# Altium schematic sheet DRV8300_GATES.SchDoc
size B
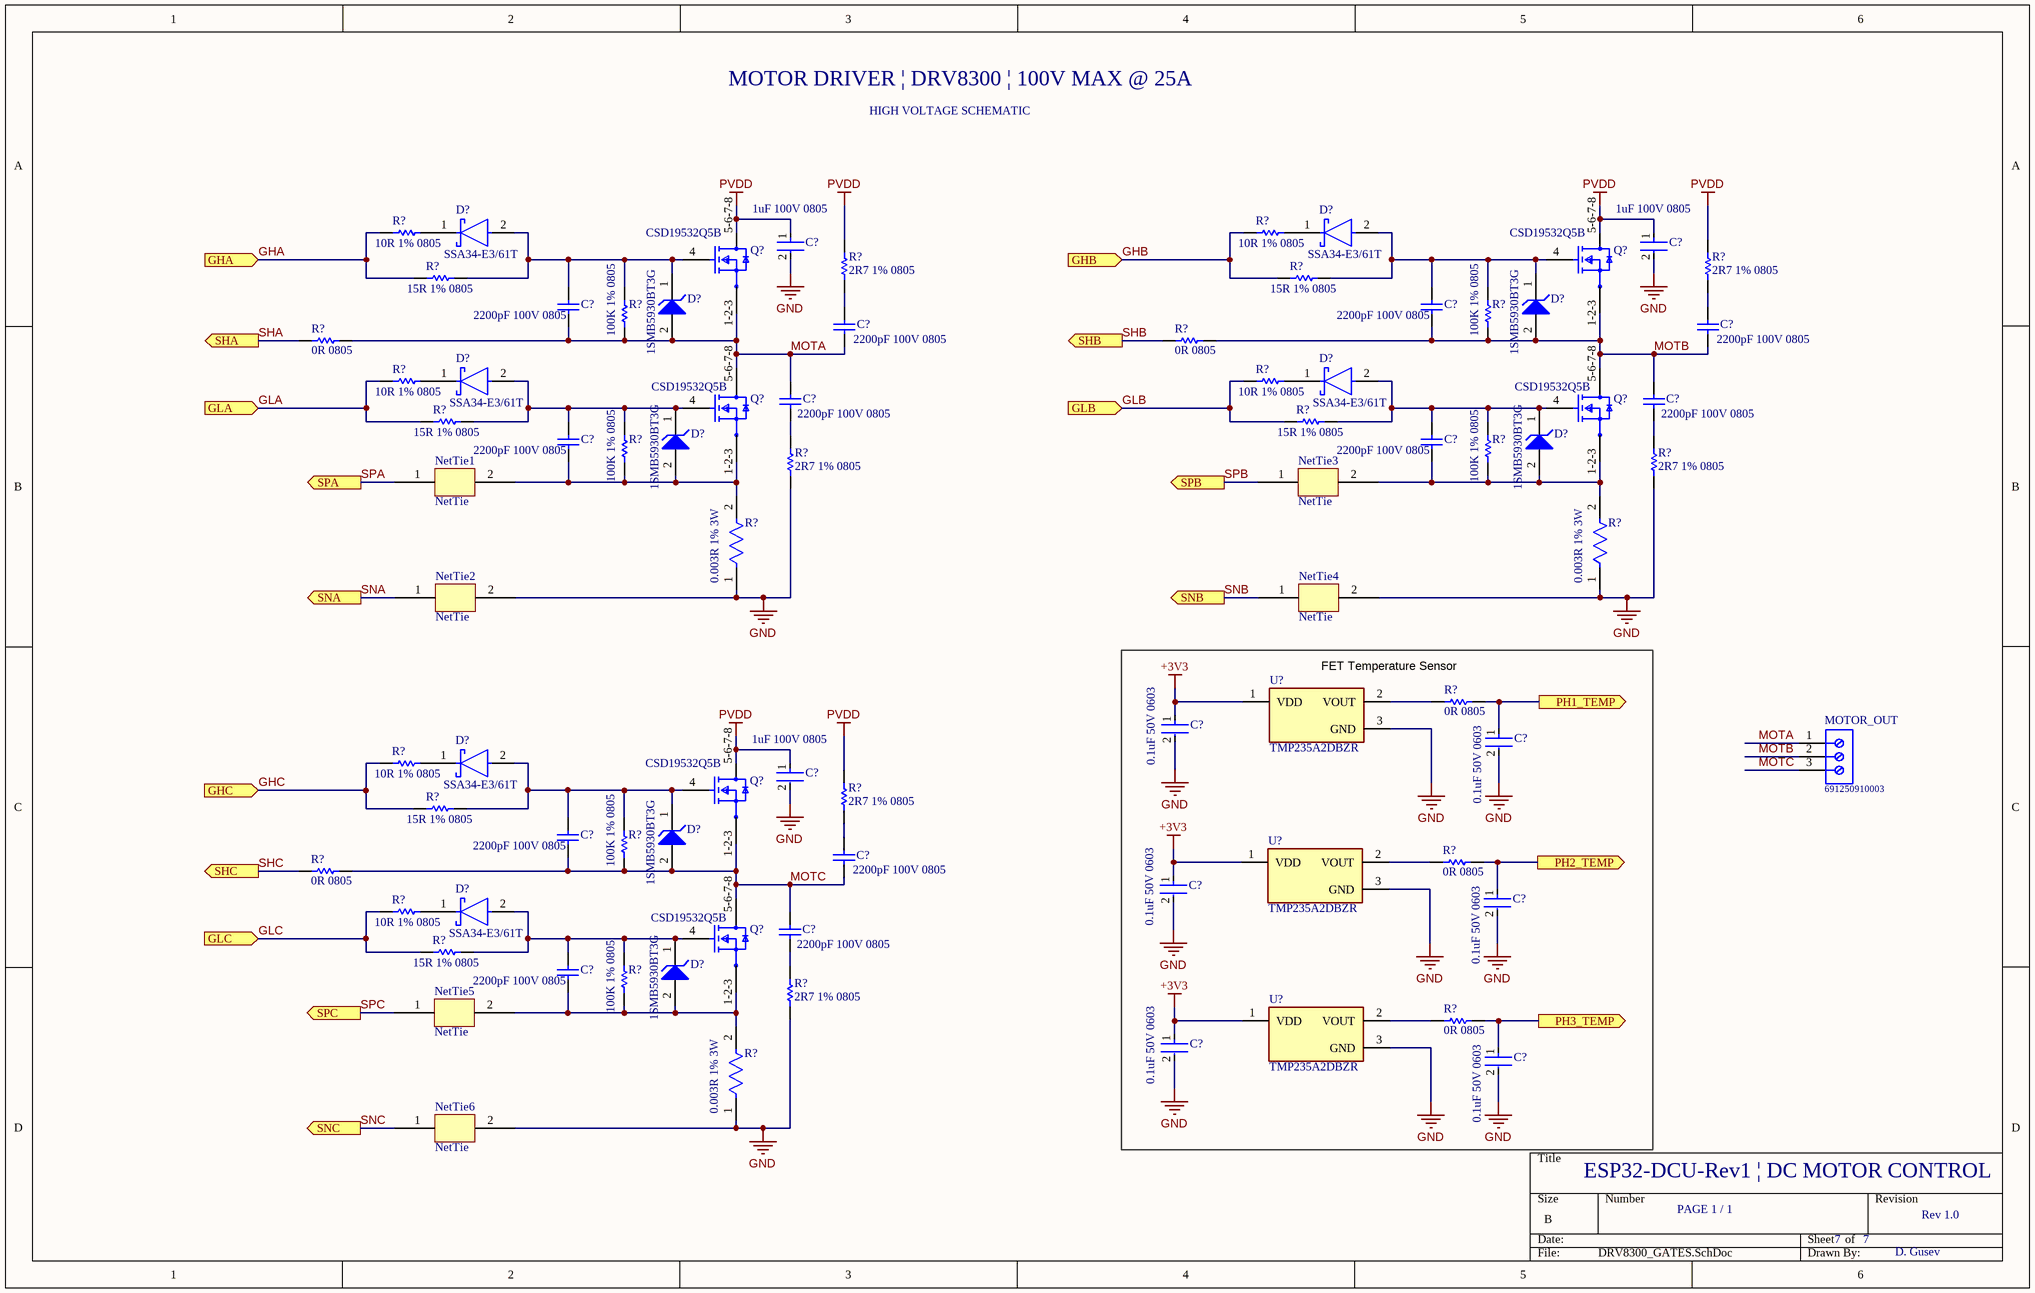
[diagram p0: DRV8300_GATES.SchDoc]

## Parts
(Parts that share a designator on the sheet are numbered #1, #2 ... from top to bottom, then left to right.)
C?#1  1uF 100V 0805  [FP-C2012-125-0_2-IPC_A]
C?#2  1uF 100V 0805  [FP-C2012-125-0_2-IPC_A]
C?#3  2200pF 100V 0805  [CAPC2013X94X50LL20T25]
C?#4  2200pF 100V 0805  [CAPC2013X94X50LL20T25]
C?#5  2200pF 100V 0805  [CAPC2013X94X50LL20T25]
C?#6  2200pF 100V 0805  [CAPC2013X94X50LL20T25]
C?#7  2200pF 100V 0805  [CAPC2013X94X50LL20T25]
C?#8  2200pF 100V 0805  [CAPC2013X94X50LL20T25]
C?#9  2200pF 100V 0805  [CAPC2013X94X50LL20T25]
C?#10  2200pF 100V 0805  [CAPC2013X94X50LL20T25]
C?#11  0.1uF 50V 0603  [FP-C0603C-CF-MFG]
C?#12  0.1uF 50V 0603  [FP-C0603C-CF-MFG]
C?#13  1uF 100V 0805  [FP-C2012-125-0_2-IPC_A]
C?#14  2200pF 100V 0805  [CAPC2013X94X50LL20T25]
C?#15  2200pF 100V 0805  [CAPC2013X94X50LL20T25]
C?#16  0.1uF 50V 0603  [FP-C0603C-CF-MFG]
C?#17  0.1uF 50V 0603  [FP-C0603C-CF-MFG]
C?#18  2200pF 100V 0805  [CAPC2013X94X50LL20T25]
C?#19  2200pF 100V 0805  [CAPC2013X94X50LL20T25]
C?#20  0.1uF 50V 0603  [FP-C0603C-CF-MFG]
C?#21  0.1uF 50V 0603  [FP-C0603C-CF-MFG]
D?#1  SSA34-E3/61T  [FP-95400-MFG]
D?#2  SSA34-E3/61T  [FP-95400-MFG]
D?#3  1SMB5930BT3G  [ONSC-SMB-2-403A-03_H_V]
D?#4  1SMB5930BT3G  [ONSC-SMB-2-403A-03_H_V]
D?#5  SSA34-E3/61T  [FP-95400-MFG]
D?#6  SSA34-E3/61T  [FP-95400-MFG]
D?#7  1SMB5930BT3G  [ONSC-SMB-2-403A-03_H_V]
D?#8  1SMB5930BT3G  [ONSC-SMB-2-403A-03_H_V]
D?#9  SSA34-E3/61T  [FP-95400-MFG]
D?#10  1SMB5930BT3G  [ONSC-SMB-2-403A-03_H_V]
D?#11  SSA34-E3/61T  [FP-95400-MFG]
D?#12  1SMB5930BT3G  [ONSC-SMB-2-403A-03_H_V]
MOTOR_OUT  691250910003  [691250910003]
NetTie1  NetTie  [NetTie]
NetTie2  NetTie  [NetTie]
NetTie3  NetTie  [NetTie]
NetTie4  NetTie  [NetTie]
NetTie5  NetTie  [NetTie]
NetTie6  NetTie  [NetTie]
Q?#1  CSD19532Q5B  [CSD19532Q5B]
Q?#2  CSD19532Q5B  [CSD19532Q5B]
Q?#3  CSD19532Q5B  [CSD19532Q5B]
Q?#4  CSD19532Q5B  [CSD19532Q5B]
Q?#5  CSD19532Q5B  [CSD19532Q5B]
Q?#6  CSD19532Q5B  [CSD19532Q5B]
R?#1  10R 1% 0805  [RESC2013X60X35ML10T20]
R?#2  10R 1% 0805  [RESC2013X60X35ML10T20]
R?#3  15R 1% 0805  [RESC2013X70X40NL20T20]
R?#4  15R 1% 0805  [RESC2013X70X40NL20T20]
R?#5  2R7 1% 0805  [RESC2013X70X40NL20T20]
R?#6  2R7 1% 0805  [RESC2013X70X40NL20T20]
R?#7  100K 1% 0805  [RESC2013X60X35ML10T20]
R?#8  100K 1% 0805  [RESC2013X60X35ML10T20]
R?#9  0R 0805  [RESC2013X60X35ML10T20]
R?#10  0R 0805  [RESC2013X60X35ML10T20]
R?#11  10R 1% 0805  [RESC2013X60X35ML10T20]
R?#12  10R 1% 0805  [RESC2013X60X35ML10T20]
R?#13  15R 1% 0805  [RESC2013X70X40NL20T20]
R?#14  15R 1% 0805  [RESC2013X70X40NL20T20]
R?#15  100K 1% 0805  [RESC2013X60X35ML10T20]
R?#16  100K 1% 0805  [RESC2013X60X35ML10T20]
R?#17  2R7 1% 0805  [RESC2013X70X40NL20T20]
R?#18  2R7 1% 0805  [RESC2013X70X40NL20T20]
R?#19  0.003R 1% 3W  [FP-CSR1225-IPC_C]
R?#20  0.003R 1% 3W  [FP-CSR1225-IPC_C]
R?#21  0R 0805  [RESC2013X60X35ML10T20]
R?#22  10R 1% 0805  [RESC2013X60X35ML10T20]
R?#23  15R 1% 0805  [RESC2013X70X40NL20T20]
R?#24  2R7 1% 0805  [RESC2013X70X40NL20T20]
R?#25  100K 1% 0805  [RESC2013X60X35ML10T20]
R?#26  0R 0805  [RESC2013X60X35ML10T20]
R?#27  0R 0805  [RESC2013X60X35ML10T20]
R?#28  10R 1% 0805  [RESC2013X60X35ML10T20]
R?#29  15R 1% 0805  [RESC2013X70X40NL20T20]
R?#30  100K 1% 0805  [RESC2013X60X35ML10T20]
R?#31  2R7 1% 0805  [RESC2013X70X40NL20T20]
R?#32  0R 0805  [RESC2013X60X35ML10T20]
R?#33  0.003R 1% 3W  [FP-CSR1225-IPC_C]
U?#1  TMP235A2DBZR  [FP-DBZ0003A-MFG]
U?#2  TMP235A2DBZR  [FP-DBZ0003A-MFG]
U?#3  TMP235A2DBZR  [FP-DBZ0003A-MFG]

## Blocks framed on the sheet
FET Temperature Sensor: C?#11 C?#12 C?#16 C?#17 C?#20 C?#21 R?#21 R?#26 R?#32 U?#1-U?#3

## Ports
GHA (in), GHB (in), GHC (in), GLA (in), GLB (in), GLC (in), PH1_TEMP (out), PH2_TEMP (out), PH3_TEMP (out), SHA (out), SHB (out), SHC (out), SNA (out), SNB (out), SNC (out), SPA (out), SPB (out), SPC (out)

## Nets
+3V3: C?#11.1 C?#16.1 C?#20.1 U?#1.1(VDD) U?#2.1(VDD) U?#3.1(VDD)
GND: C?#1.2 C?#2.2 C?#11.2 C?#12.2 C?#13.2 C?#16.2 C?#17.2 C?#20.2 C?#21.2 NetTie2.2 NetTie4.2 NetTie6.2 R?#17.1 R?#18.1 R?#19.1 R?#20.1 R?#31.1 R?#33.1 U?#1.3(GND) U?#2.3(GND) U?#3.3(GND)
PVDD: C?#1.1 C?#2.1 C?#13.1 Q?#1.5-6-7-8(D) Q?#2.5-6-7-8(D) Q?#5.5-6-7-8(D) R?#5.2 R?#6.2 R?#24.2
GHA: R?#1.1 R?#3.1 ; port GHA
GHB: R?#2.1 R?#4.1 ; port GHB
GHC: R?#22.1 R?#23.1 ; port GHC
GLA: R?#11.1 R?#13.1 ; port GLA
GLB: R?#12.1 R?#14.1 ; port GLB
GLC: R?#28.1 R?#29.1 ; port GLC
MOTA: C?#3.1 C?#5.1 C?#7.2 D?#3.2(A) MOTOR_OUT.1 Q?#1.1-2-3(S) Q?#3.5-6-7-8(D) R?#7.1 R?#9.2
MOTB: C?#4.1 C?#6.1 C?#8.2 D?#4.2(A) MOTOR_OUT.2 Q?#2.1-2-3(S) Q?#4.5-6-7-8(D) R?#8.1 R?#10.2
MOTC: C?#14.1 C?#15.1 C?#18.2 D?#10.2(A) MOTOR_OUT.3 Q?#5.1-2-3(S) Q?#6.5-6-7-8(D) R?#25.1 R?#27.2
PH1_TEMP: C?#12.1 R?#21.2 ; port PH1_TEMP
PH2_TEMP: C?#17.1 R?#26.2 ; port PH2_TEMP
PH3_TEMP: C?#21.1 R?#32.2 ; port PH3_TEMP
SHA: R?#9.1 ; port SHA
SHB: R?#10.1 ; port SHB
SHC: R?#27.1 ; port SHC
SNA: NetTie2.1 ; port SNA
SNB: NetTie4.1 ; port SNB
SNC: NetTie6.1 ; port SNC
SPA: NetTie1.1 ; port SPA
SPB: NetTie3.1 ; port SPB
SPC: NetTie5.1 ; port SPC
NetC?#3_2: C?#3.2 D?#1.2(A) D?#3.1(K) Q?#1.4(G) R?#3.2 R?#7.2
NetC?#4_2: C?#4.2 D?#2.2(A) D?#4.1(K) Q?#2.4(G) R?#4.2 R?#8.2
NetC?#5_2: C?#5.2 R?#5.1
NetC?#6_2: C?#6.2 R?#6.1
NetC?#7_1: C?#7.1 R?#17.2
NetC?#8_1: C?#8.1 R?#18.2
NetC?#9_1: C?#9.1 D?#7.2(A) NetTie1.2 Q?#3.1-2-3(S) R?#15.1 R?#19.2
NetC?#9_2: C?#9.2 D?#5.2(A) D?#7.1(K) Q?#3.4(G) R?#13.2 R?#15.2
NetC?#10_1: C?#10.1 D?#8.2(A) NetTie3.2 Q?#4.1-2-3(S) R?#16.1 R?#20.2
NetC?#10_2: C?#10.2 D?#6.2(A) D?#8.1(K) Q?#4.4(G) R?#14.2 R?#16.2
NetC?#14_2: C?#14.2 D?#9.2(A) D?#10.1(K) Q?#5.4(G) R?#23.2 R?#25.2
NetC?#15_2: C?#15.2 R?#24.1
NetC?#18_1: C?#18.1 R?#31.2
NetC?#19_1: C?#19.1 D?#12.2(A) NetTie5.2 Q?#6.1-2-3(S) R?#30.1 R?#33.2
NetC?#19_2: C?#19.2 D?#11.2(A) D?#12.1(K) Q?#6.4(G) R?#29.2 R?#30.2
NetD?#1_1: D?#1.1(C) R?#1.2
NetD?#2_1: D?#2.1(C) R?#2.2
NetD?#5_1: D?#5.1(C) R?#11.2
NetD?#6_1: D?#6.1(C) R?#12.2
NetD?#9_1: D?#9.1(C) R?#22.2
NetD?#11_1: D?#11.1(C) R?#28.2
NetR?#21_1: R?#21.1 U?#1.2(VOUT)
NetR?#26_1: R?#26.1 U?#2.2(VOUT)
NetR?#32_1: R?#32.1 U?#3.2(VOUT)

## Notes on the sheet
- MOTOR DRIVER | DRV8300 | 100V MAX @ 25A
- HIGH VOLTAGE SCHEMATIC
- ESP32-DCU-Rev1 | DC MOTOR CONTROL
- PAGE 1 / 1
- 7
- Rev 1.0
- D. Gusev

## Library data of the parts
C?#1 C?#2 C?#13 = CMP-2000-05454-2: Multilayer Ceramic Capacitors 1μF ±10% 100V X7S SMD 0805; Case Code (Metric): 2012; Capacitance: 1uF; Width: 1.25mm; Mount: Surface Mount; Package Quantity: 1; RoHS Compliant: Yes; Case Code (Imperial): 0805; REACH SVHC: No SVHC; Resistor Type: Ceramic; Depth: 1.25mm; Dielectric: X7S; Thickness: 0.053inch; Case/Package: 0805; Lead Free: Lead Free; Length: 2mm; Series: C; Voltage Rating (DC): 100V; Voltage: 100V; Height: 1.25mm; Min Operating Temperature: -55°C; Termination: SMD/SMT; Weight: 0.000194oz; Max Operating Temperature: 125°C; Number of Pins: 2; Tolerance: 10%; Packaging: Tape and Reel; Voltage Rating: 100V
C?#3-C?#10 C?#14 C?#15 C?#18 C?#19 = CMP-2007-04184-1: Part Number: 08051C222JAT2A; Manufacturer: AVX Interconnect / Elco
C?#11 C?#12 C?#16 C?#17 C?#20 C?#21 = CMP-2006-03061-2: CAP CER 0.1UF 50V X7R 0603; Manufacturer: KEMET; Manufacturer Part Number: C0603C104K5RACTU; Tolerance: 0.1; Description: C0603 0.10 μF X7R 30ppm/°C 10.00% 50 V; Temperature Coefficient: 30ppm/°C; Material: Ceramic; Automotive Grade: Grade 1; Value: 0.10 μF; Temperature: -55°C to +125°C; RoHS: TRUE; Temperature Range High: +125°C; Lead Free: Yes; Octopart: https://octopart.com/c0603c104k5ractu-kemet-139244; Digikey Description: CAP CER 0.1UF 50V X7R 0603; Category: Cap; Package: C0603C-CF; ComponentLink2Description: Datasheet; Temperature Range Low: -55°C; Device Class L1: Passive Components; Voltage Rating: 50 V; Automotive: Yes; Device Class L3: Ceramic Capacitors; ComponentLink2URL: https://api.kemet.com/component-edge/download/datasheet/C0603C100J5GACAUTO.pdf; Capacitance: 0.10 μF; Device Class L2: Capacitors; Temperature Characteristic: X7R; Height: 0.87mm
D?#1 D?#2 D?#5 D?#6 D?#9 D?#11 = CMP-02539-000022-2: DIODE SCHOTTKY 40V 3A DO214AC; Element Configuration: Single; Max Reverse Leakage Current: 200uA; Polarity: Standard; Peak Non-Repetitive Surge Current: 75A; Forward Voltage: 490mV; Radiation Hardening: No; Current Rating: 3A; Contact Plating: Tin; Output Current: 3A; Height: 2.087mm; Mount: Surface Mount; Case/Package: SMA; Packaging: Tape and Reel; Width: 2.79mm; Average Rectified Current: 3A; Max Repetitive Reverse Voltage (Vrrm): 40V; Max Operating Temperature: 150°C; Length: 4.5mm; RoHS Compliant: Yes; Max Reverse Current: 200uA; Voltage Rating (DC): 40V; Min Operating Temperature: -65°C; Max Reverse Voltage (DC): 40V; Number of Pins: 2; Max Forward Surge Current (Ifsm): 75A; Lead Free: Lead Free; Forward Current: 3A; Max Surge Current: 75A; Package Quantity: 1
D?#3 D?#4 D?#7 D?#8 D?#10 D?#12 = CMP-1060-00159-1: 3 W Zener Voltage Regulator, 2-Pin SMB, Pb-Free, Tape and Reel; Manufacturer: On Semiconductor; VZ Typ (V): 16; PackageReference: SMB-2-403A-03_H; Mounting Technology: Surface Mount; RoHS: Pb-Free; PackageVersion: Rev. H, 05/2011; ComponentLink2URL: http://www.onsemi.com/pub_link/Collateral/1SMB5913BT3-D.PDF; PartNumber: 1SMB5930BT3G; ComponentLink2Description: Datasheet; ComponentLink1Description: Manufacturer URL; ComponentLink1URL: http://www.onsemi.com/; DatasheetVersion: Rev. 8; Packing: Tape and Reel; PackageDescription: 2-Pin Small Molded Package, J-Bend Lead, Body 4.33 x 3.625 mm; ComponentLink3URL: http://www.onsemi.com/pub_link/Collateral/1SMB5913BT3-D.PDF; ComponentLink3Description: Package Specification
MOTOR_OUT = CMP-1502-02751-1: Serie 2509 - 9.52 mm Horizontal Entry Modular with Rising Cage Clamp WR-TBL, 3 pin; Manufacturer: Wurth Elektronik; Pin Number: 3; Pitch: 9.52mm; Publisher: WurthElektronik; Mounting Technology: THT; Packaging: Box; Part Number: 691250910003; Manufacturer URL: http://www.we-online.de; Operating Temperature: -30to120degC; Datasheet URL: http://katalog.we-online.de/em/datasheet/6912509100XX.pdf; Package Reference: 691250910003
NetTie1-NetTie6 = NetTie: Connection between two nets
Q?#1-Q?#6 = CSD19532Q5B: MOSFET N-CH 100V 100A 8SON; Manufacturer: Texas Instruments; Depletion Mode: False; Number Of Channels: 1; Gate To Source Voltage: 20V; Reverse Recovery Time: 80ns; Input Capacitace At Vds: 3700pF @ 50V; Max Forward Diode Voltage: 1V; Turn Off Delay Time: 22ns; Drain To Source Resistance: 4.6mΩ; Threshold Vgs Max: 3.2V; Max Junction Temp: +150°C; Turn On Delay Time: 7ns; Pulse Drain Current: 400A; Rthja Max: 50°C/W; Typ Forward Diode Voltage: 0.8V; Reverse Recovery Charge: 249nC; Threshold Vgs Min: 2.2V; Gate Charge At Vgs: 48nC @ 10V; Power Dissipation: 3.1W; Transconductance: 84S; Temperature Range Low: -55°C; Automotive: No; RoHS: TRUE; Temperature: -55°C to +150°C; Device Class L3: MOSFETs; Continuous Drain Current: 100A; Number Of N Channels: 1; Height: 1.05mm; Mouser Description: MOSFET 100V 4.0 mOhm N-Ch NexFET Power MOSFET; Drain To Source Voltage: 100V; Temperature Range High: +150°C; Manufacturer Part Number: CSD19532Q5B; Octopart: https://octopart.com/csd19532q5b-texas+instruments-32890191; ComponentLink2URL: http://www.ti.com/lit/ds/symlink/csd19532q5b.pdf; Lead Free: Yes; Drain To Source Breakdown Voltage: 100V; Device Class L1: Discrete Semiconductors; Device Class L2: Transistors; Package: DNK0008A; Digikey Description: MOSFET N-CH 100V 100A 8SON; Category: Trans; ComponentLink2Description: Datasheet
R?#1 R?#2 R?#11 R?#12 R?#22 R?#28 = CMP-2100-03670-1: Chip Resistor, 10 Ohm, +/- 1%, 0.125 W, -55 to 155 degC, 0805 (2012 Metric), RoHS, Tape and Reel; Manufacturer: Yageo; Resistance: 10Ohm; Power Rating: 125mW; Voltage Rating: 150V; Temperature Coefficient: 200ppm/degreesC; Number of Pins: 2; REACH SVHC: NoSVHC; Datasheet Version: Rev. 5, 10/2016; Max Operating Temperature: 155degC; Manufacturer URL: http://www.yageo.com/; Case Code (Imperial): 0805; Package Description: 2-Pin Surface Mounted Device, Body 2 x 1.25 mm; Case Code (Metric): 2012; Length: 2mm; RoHSCompliant: true; Max Power Dissipation: 125mW; Depth: 1.25mm; Packaging: TapeandReel; Height: 0.5mm; Package Reference: 0805; Package Quantity: 1; Tolerance: 1%; Termination: SMD/SMT; Min Operating Temperature: -55degC; Lead Free: LeadFree; Width: 1.25mm; Voltage Rating (DC): 150V; Datasheet URL: http://www.yageo.com/NewPortal/yageodocoutput?fileName=/pdf/R-Chip/PYu-RC_Group_51_RoHS_L_5.pdf; Composition: ThickFilm; Number of Terminations: 2; Case/Package: 0805
R?#3 R?#4 R?#13 R?#14 R?#23 R?#29 = CMP-1013-00302-2: Part Number: ERJ-6ENF15R0V; Manufacturer: Panasonic
R?#5 R?#6 R?#17 R?#18 R?#24 R?#31 = CMP-2001-00461-1: Part Number: ERJ-6RQF2R7V; Manufacturer: Panasonic
R?#7 R?#8 R?#15 R?#16 R?#25 R?#30 = CMP-2100-03668-1: Chip Resistor, 100 KOhm, +/- 1%, 0.125 W, -55 to 155 degC, 0805 (2012 Metric), RoHS, Tape and Reel; Manufacturer: Yageo; Max Power Dissipation: 125mW; Voltage Rating: 150V; Temperature Coefficient: 100ppm/degreesC; Manufacturer URL: http://www.yageo.com/; Min Operating Temperature: -55degC; Lead Pitch: 0.4mm; Composition: ThickFilm; Case Code (Metric): 2012; Military Standard: Not; Package Description: 2-Pin Surface Mounted Device, Body 2 x 1.25 mm; REACH SVHC: Unknown; RoHSCompliant: true; Depth: 1.25mm; Number of Pins: 2; Lead Free: LeadFree; Resistance: 100KOhm; Datasheet URL: http://www.yageo.com/NewPortal/yageodocoutput?fileName=/pdf/R-Chip/PYu-RC_Group_51_RoHS_L_5.pdf; Max Operating Temperature: 155degC; Case/Package: 0805; Package Quantity: 1; Case Code (Imperial): 0805; Power Rating: 125mW; Width: 0.049inch; Package Reference: 0805; Height: 0.024inch; Termination: SMD/SMT; Tolerance: 1%; Datasheet Version: Rev. 5, 10/2016; Length: 2mm; Voltage Rating (DC): 150V; Number of Terminations: 2; Packaging: TapeandReel
R?#9 R?#10 R?#21 R?#26 R?#27 R?#32 = CMP-2100-03673-1: Chip Resistor, 0 Ohm, Jumper, +/- 5%, 0.125 W, -55 to 155 degC, 0805 (2012 Metric), RoHS, Tape and Reel; Manufacturer: Yageo; Power Rating: 125mW; Resistance: 0mOhm; Voltage Rating (DC): 150V; Temperature Coefficient: 200ppm/degreesC; Height: 0.5mm; Depth: 1.25mm; Case Code (Imperial): 0805; Lead Free: LeadFree; Military Standard: Not; Package Description: 2-Pin Surface Mounted Device, Body 2 x 1.25 mm; Case Code (Metric): 2012; Composition: ThickFilm; Voltage Rating: 150V; Manufacturer URL: http://www.yageo.com/; Packaging: TapeandReel; Package Reference: 0805; REACH SVHC: Unknown; Tolerance: 5%; Case/Package: 0805; Max Operating Temperature: 155degC; Number of Pins: 2; Min Operating Temperature: -55degC; RoHSCompliant: true; Length: 2mm; Datasheet URL: http://www.yageo.com/NewPortal/yageodocoutput?fileName=/pdf/R-Chip/PYu-RC_Group_51_RoHS_L_5.pdf; Termination: SMD/SMT; Radiation Hardening: No; Width: 1.25mm; Contact Plating: Tin; Datasheet Version: Rev. 5, 10/2016
R?#19 R?#20 R?#33 = CMP-26527-005975-1: General Purpose Thick Film Chip Resistor, 1225, 3mΩ, 1%, 200ppm/°C, 3W; Resistance: 3mR; Min Operating Temperature: -55°C; Max Operating Temperature: 155°C; Power Rating: 3W; Lead Free: Lead Free; Resistor Type: Thick Film; RoHS Compliant: Yes; Case/Package: 1225; Contact Plating: Tin; Mount: Surface Mount; Temperature Coefficient: 200ppm/°C; Packaging: Tape and Reel; Tolerance: 1%; Radiation Hardening: No
U?#1-U?#3 = CMP-04948-000003-1: LOW-POWER HIGH-ACCURACY ANALOG O; Manufacturer: Texas Instruments; Output Current: 500uA; Operating Supply Current: 9uA; Max Supply Voltage: 5.5V; Max Junction Temp: +150°C; Accuracy: 0.5%; Min Supply Voltage: 2.3V; Standoff Height: 0.01mm; Sensor Output: Analog Voltage; Description: Temperature Sensor Analog, Local -40°C ~ 150°C 10mV/°C SOT-23-3; Ambient Temperature Range Low: -40°C; Device Class L2: Temperature and Humidity Sensors; Digikey Description: LOW-POWER HIGH-ACCURACY ANALOG O; Lead Free: Yes; Category: IC; Device Class L3: unset; Temperature Range Low: -40°C; Manufacturer Part Number: TMP235A2DBZR; ComponentLink2Description: Datasheet; Package: DBZ0003A; Octopart: https://octopart.com/tmp235a2dbzr-texas+instruments-94966376; Device Class L1: Sensors; Temperature Range High: +150°C; Height: 1.12mm; Temperature: -40°C to +150°C; RoHS: TRUE; Ambient Temperature Range High: +150°C; Automotive: No; ComponentLink2URL: http://www.ti.com/lit/ds/symlink/tmp235.pdf; Mouser Description: ±2°C Analog output temperature sensor, with 10mV /°C gain 3-SOT-23 -40 to 150